# EAGLE schematic riser (EAGLE 7.7.0)

## Sheet 1 of 4: Host and PCIe Slot
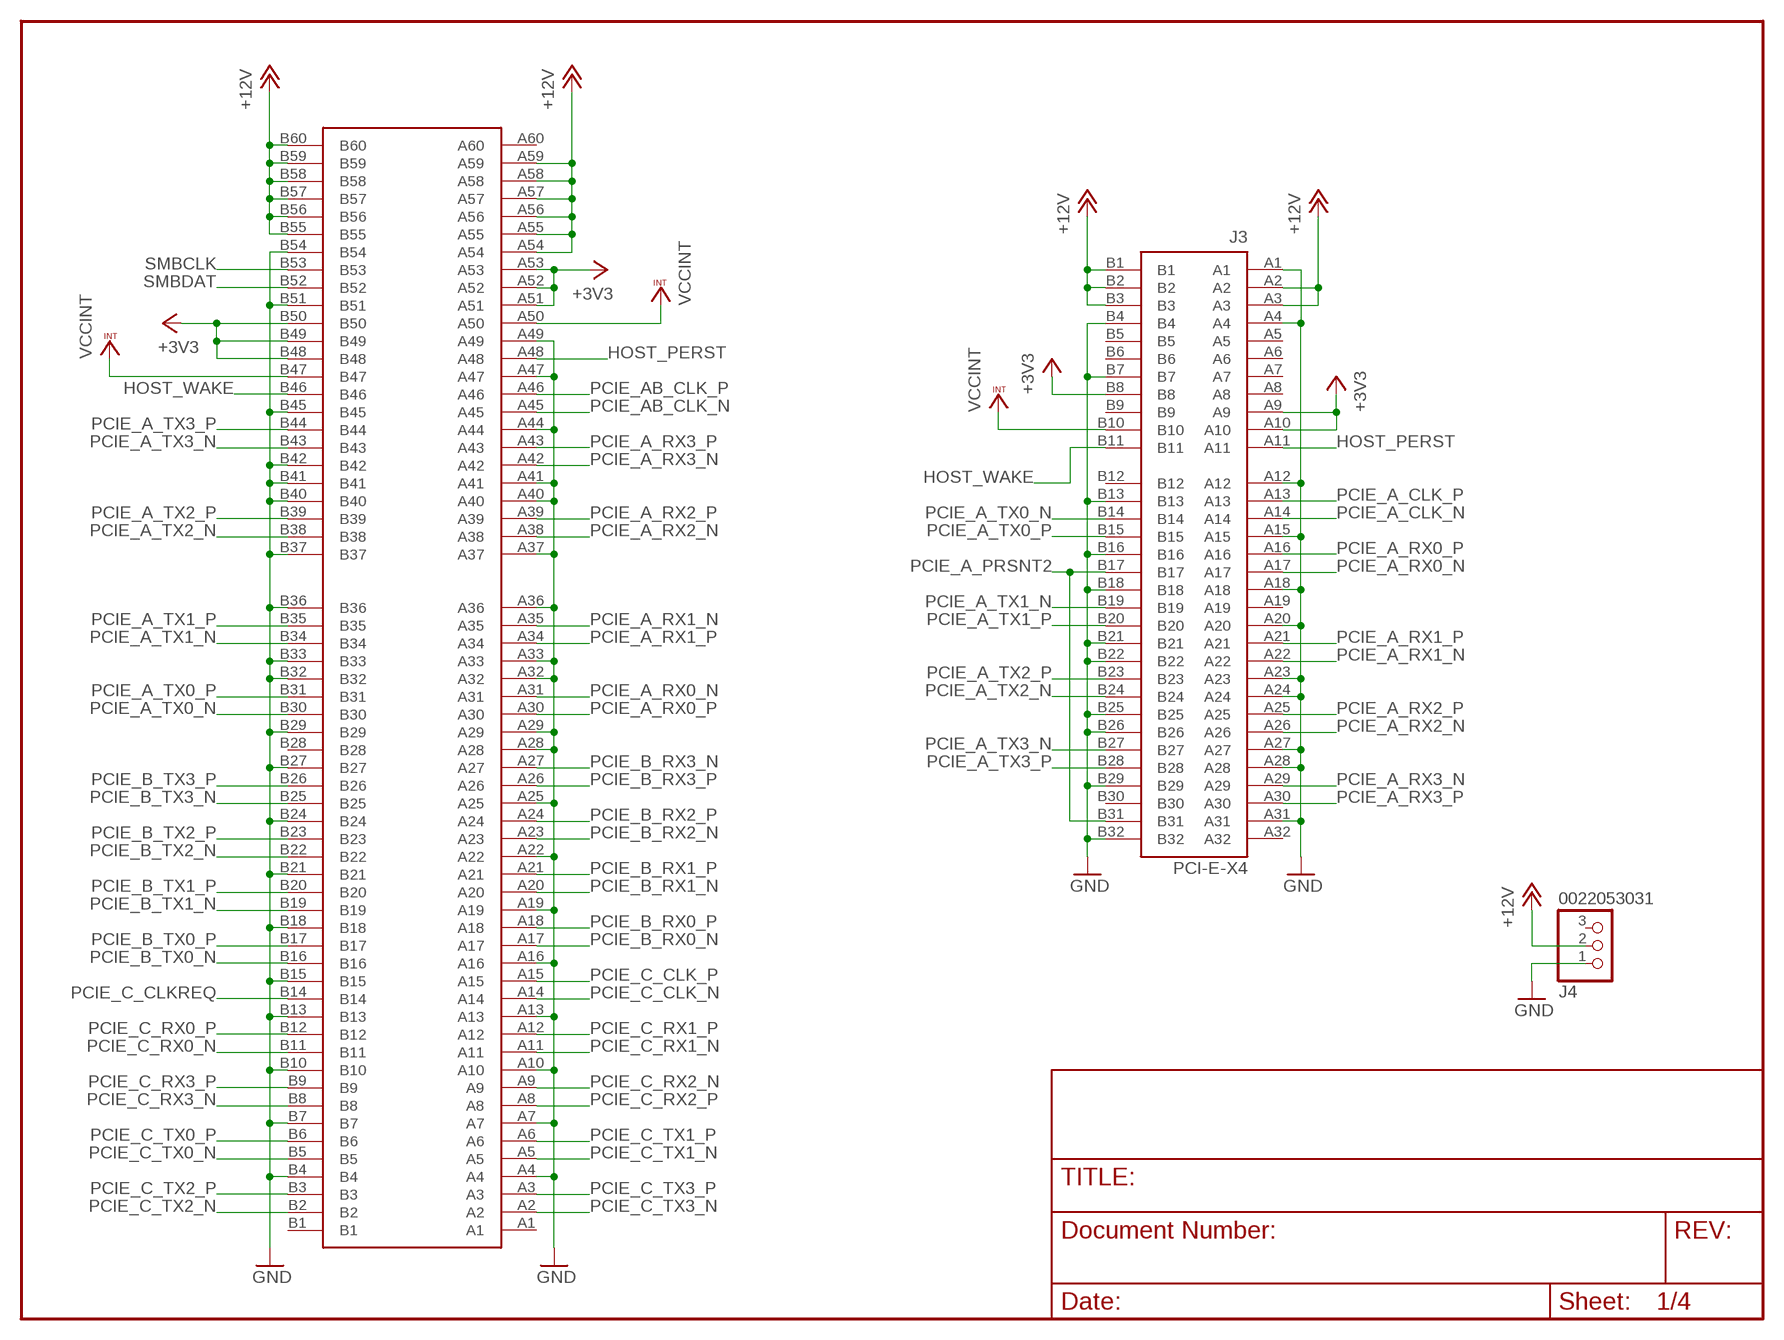
[diagram p0: schematic, sheet 1]

### Parts
J3  PCI-E-X4  [PCI-E-X4]
J4  0022053031  PINHD-1X3  [1X03]
JP1  ADDR0262  [ADDR0262-EDGE]

### Nets
+3V3: J3.A9 J3.A10 J3.B8 JP1.A51 JP1.A52 JP1.A53 JP1.B48 JP1.B49 JP1.B50 ; also sheet 3
+12V: J3.A2 J3.A3 J3.B1 J3.B2 J3.B3 J4.2 JP1.A54 JP1.A55 JP1.A56 JP1.A57 JP1.A58 JP1.A59 JP1.B55 JP1.B56 JP1.B57 JP1.B58 JP1.B59 JP1.B60 ; also sheet 3
GND: J3.A1 J3.A4 J3.A12 J3.A15 J3.A18 J3.A20 J3.A23 J3.A24 J3.A27 J3.A28 J3.A31 J3.B4 J3.B7 J3.B13 J3.B16 J3.B18 J3.B21 J3.B22 J3.B25 J3.B26 J3.B29 J3.B32 J4.1 JP1.A4 JP1.A7 JP1.A10 JP1.A13 JP1.A16 JP1.A19 JP1.A22 JP1.A25 JP1.A28 JP1.A29 JP1.A32 JP1.A33 JP1.A36 JP1.A37 JP1.A40 JP1.A41 JP1.A44 JP1.A47 JP1.A49 JP1.B4 JP1.B7 JP1.B10 JP1.B13 JP1.B15 JP1.B18 JP1.B21 JP1.B24 JP1.B27 JP1.B29 JP1.B32 JP1.B33 JP1.B36 JP1.B37 JP1.B40 JP1.B41 JP1.B42 JP1.B45 JP1.B51 JP1.B54 ; also sheet 2,3
HOST_PERST: J3.A11 JP1.A48 ; also sheet 3
HOST_WAKE: J3.B11 JP1.B46 ; also sheet 3
PCIE_A_CLK_N [pcie]: J3.A14 ; also sheet 3
PCIE_A_CLK_P [pcie]: J3.A13 ; also sheet 3
PCIE_A_PRSNT2: J3.B17 J3.B31 ; also sheet 3
PCIE_A_RX0_N [pcie]: J3.A17 JP1.A31
PCIE_A_RX0_P [pcie]: J3.A16 JP1.A30
PCIE_A_RX1_N [pcie]: J3.A22 JP1.A35
PCIE_A_RX1_P [pcie]: J3.A21 JP1.A34
PCIE_A_RX2_N [pcie]: J3.A26 JP1.A38
PCIE_A_RX2_P [pcie]: J3.A25 JP1.A39
PCIE_A_RX3_N [pcie]: J3.A29 JP1.A42
PCIE_A_RX3_P [pcie]: J3.A30 JP1.A43
PCIE_A_TX0_N [pcie]: J3.B14 JP1.B30
PCIE_A_TX0_P [pcie]: J3.B15 JP1.B31
PCIE_A_TX1_N [pcie]: J3.B19 JP1.B34
PCIE_A_TX1_P [pcie]: J3.B20 JP1.B35
PCIE_A_TX2_N [pcie]: J3.B24 JP1.B38
PCIE_A_TX2_P [pcie]: J3.B23 JP1.B39
PCIE_A_TX3_N [pcie]: J3.B27 JP1.B43
PCIE_A_TX3_P [pcie]: J3.B28 JP1.B44
PCIE_AB_CLK_N [pcie]: JP1.A45 ; also sheet 3
PCIE_AB_CLK_P [pcie]: JP1.A46 ; also sheet 3
PCIE_B_RX0_N [pcie]: JP1.A17 ; also sheet 2
PCIE_B_RX0_P [pcie]: JP1.A18 ; also sheet 2
PCIE_B_RX1_N [pcie]: JP1.A20 ; also sheet 2
PCIE_B_RX1_P [pcie]: JP1.A21 ; also sheet 2
PCIE_B_RX2_N [pcie]: JP1.A23 ; also sheet 2
PCIE_B_RX2_P [pcie]: JP1.A24 ; also sheet 2
PCIE_B_RX3_N [pcie]: JP1.A27 ; also sheet 2
PCIE_B_RX3_P [pcie]: JP1.A26 ; also sheet 2
PCIE_B_TX0_N [pcie]: JP1.B16 ; also sheet 2
PCIE_B_TX0_P [pcie]: JP1.B17 ; also sheet 2
PCIE_B_TX1_N [pcie]: JP1.B19 ; also sheet 2
PCIE_B_TX1_P [pcie]: JP1.B20 ; also sheet 2
PCIE_B_TX2_N [pcie]: JP1.B22 ; also sheet 2
PCIE_B_TX2_P [pcie]: JP1.B23 ; also sheet 2
PCIE_B_TX3_N [pcie]: JP1.B25 ; also sheet 2
PCIE_B_TX3_P [pcie]: JP1.B26 ; also sheet 2
PCIE_C_CLK_N [pcie]: JP1.A14 ; also sheet 2
PCIE_C_CLK_P [pcie]: JP1.A15 ; also sheet 2
PCIE_C_CLKREQ: JP1.B14 ; also sheet 2
PCIE_C_RX0_N [pcie]: JP1.B11 ; also sheet 2
PCIE_C_RX0_P [pcie]: JP1.B12 ; also sheet 2
PCIE_C_RX1_N [pcie]: JP1.A11 ; also sheet 2
PCIE_C_RX1_P [pcie]: JP1.A12 ; also sheet 2
PCIE_C_RX2_N [pcie]: JP1.A9 ; also sheet 2
PCIE_C_RX2_P [pcie]: JP1.A8 ; also sheet 2
PCIE_C_RX3_N [pcie]: JP1.B8 ; also sheet 2
PCIE_C_RX3_P [pcie]: JP1.B9 ; also sheet 2
PCIE_C_TX0_N [pcie]: JP1.B5 ; also sheet 2
PCIE_C_TX0_P [pcie]: JP1.B6 ; also sheet 2
PCIE_C_TX1_N [pcie]: JP1.A5 ; also sheet 2
PCIE_C_TX1_P [pcie]: JP1.A6 ; also sheet 2
PCIE_C_TX2_N [pcie]: JP1.B2 ; also sheet 2
PCIE_C_TX2_P [pcie]: JP1.B3 ; also sheet 2
PCIE_C_TX3_N [pcie]: JP1.A2 ; also sheet 2
PCIE_C_TX3_P [pcie]: JP1.A3 ; also sheet 2
SMBCLK: JP1.B53 ; also sheet 3
SMBDAT: JP1.B52 ; also sheet 3
VCCINT: J3.B10 JP1.A50 JP1.B47 ; also sheet 3
Unconnected: J3.A5 J3.A6 J3.A7 J3.A8 J3.A19 J3.A32 J3.B5 J3.B6 J3.B9 J3.B12 J3.B30 J4.3 JP1.A1 JP1.A60 JP1.B1 JP1.B28

## Sheet 2 of 4: M.2
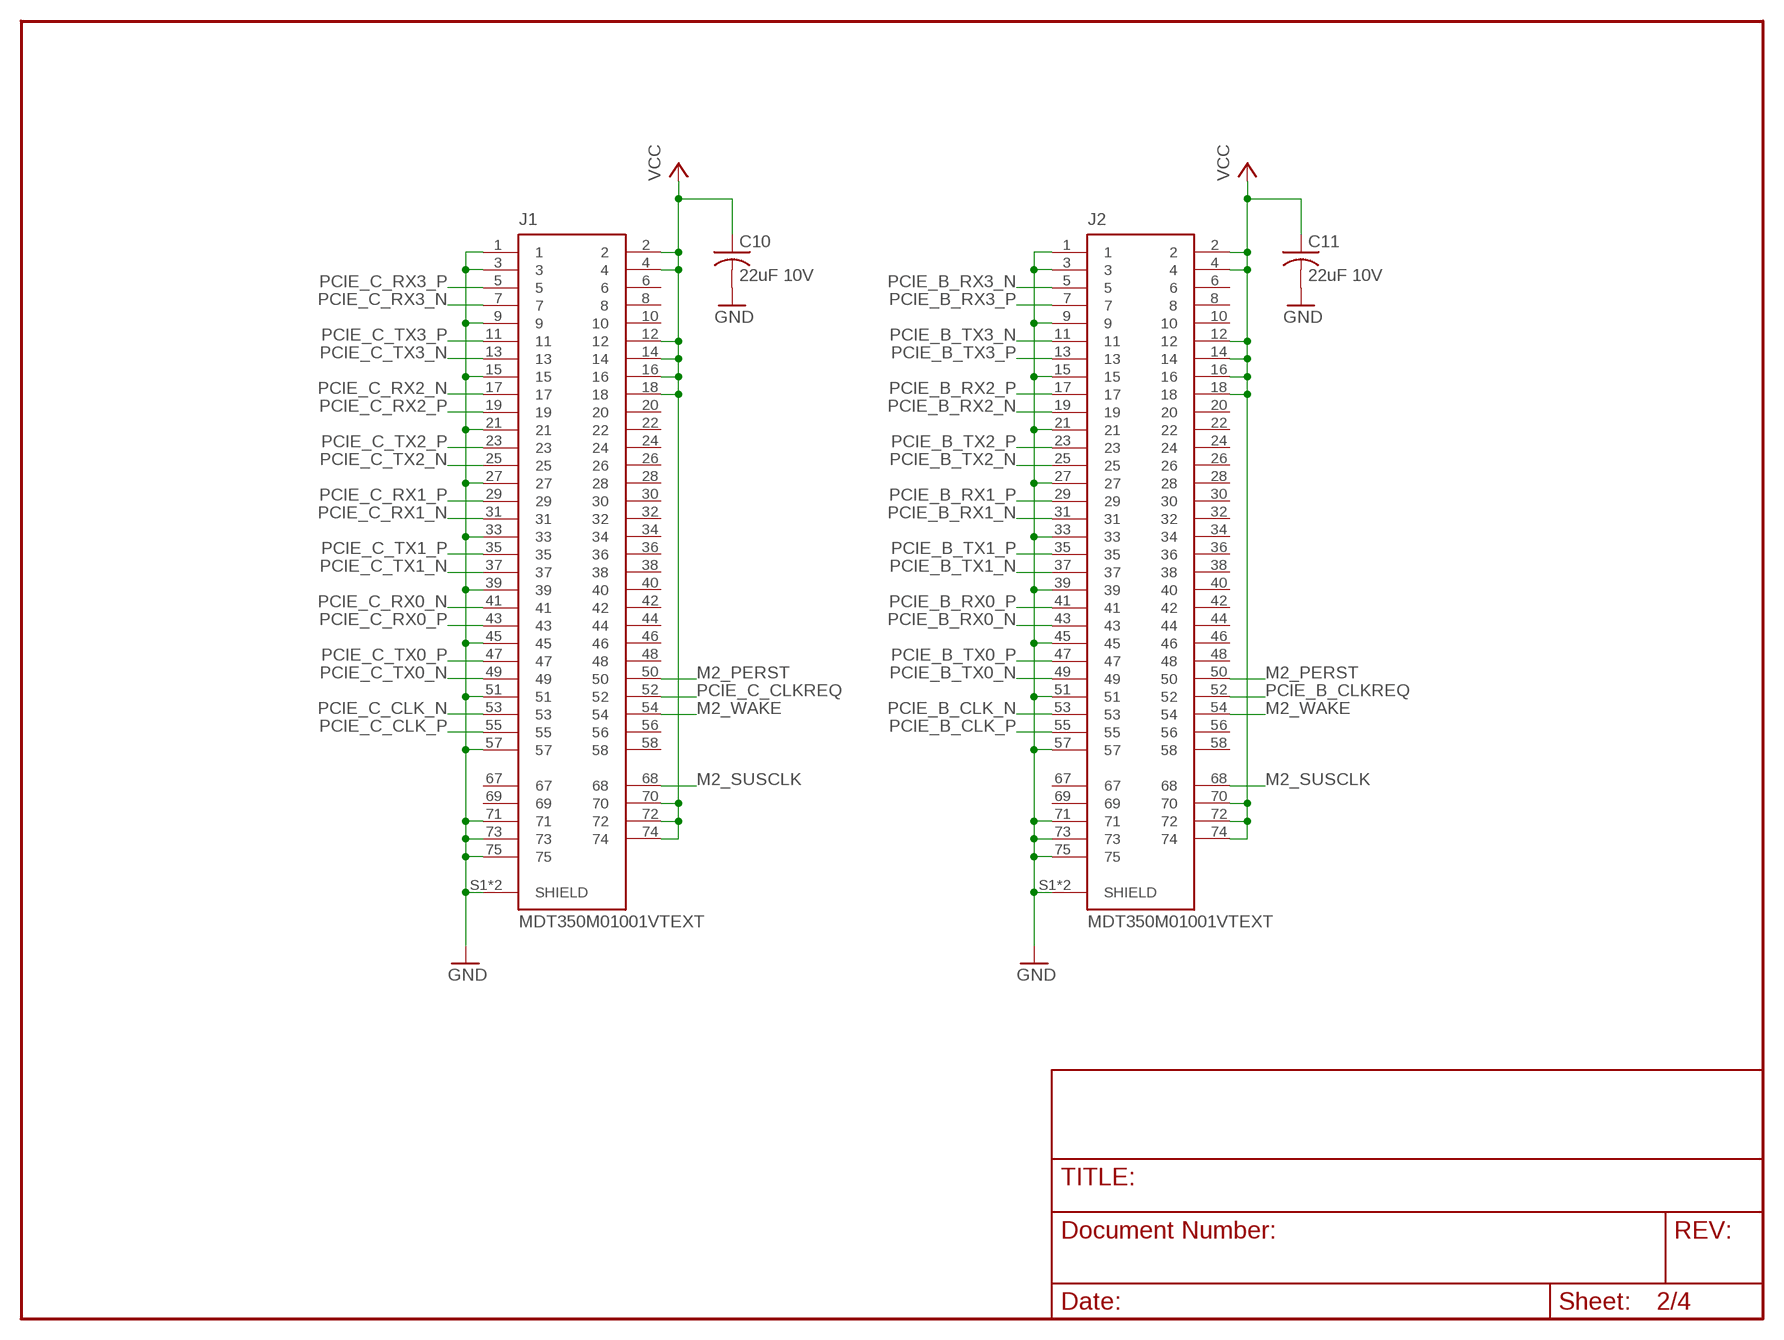
[diagram p1: schematic, sheet 2]

### Parts
C10  22uF 10V  C-USC0805  [C0805]
C11  22uF 10V  C-USC0805  [C0805]
J1  MDT350M01001VTEXT  [MDT350M01001VT_EXT]
J2  MDT350M01001VTEXT  [MDT350M01001VT_EXT]

### Nets
GND: C10.2 C11.2 J1.1 J1.3 J1.9 J1.15 J1.21 J1.27 J1.33 J1.39 J1.45 J1.51 J1.57 J1.71 J1.73 J1.75 J1.S1(SHIELD) J1.S2(SHIELD) J2.1 J2.3 J2.9 J2.15 J2.21 J2.27 J2.33 J2.39 J2.45 J2.51 J2.57 J2.71 J2.73 J2.75 J2.S1(SHIELD) J2.S2(SHIELD) ; also sheet 1,3
M2_PERST: J1.50 J2.50 ; also sheet 3
M2_SUSCLK: J1.68 J2.68 ; also sheet 3
M2_WAKE: J1.54 J2.54 ; also sheet 3
PCIE_B_CLK_N [pcie]: J2.53 ; also sheet 3
PCIE_B_CLK_P [pcie]: J2.55 ; also sheet 3
PCIE_B_CLKREQ: J2.52 ; also sheet 3
PCIE_B_RX0_N [pcie]: J2.43 ; also sheet 1
PCIE_B_RX0_P [pcie]: J2.41 ; also sheet 1
PCIE_B_RX1_N [pcie]: J2.31 ; also sheet 1
PCIE_B_RX1_P [pcie]: J2.29 ; also sheet 1
PCIE_B_RX2_N [pcie]: J2.19 ; also sheet 1
PCIE_B_RX2_P [pcie]: J2.17 ; also sheet 1
PCIE_B_RX3_N [pcie]: J2.5 ; also sheet 1
PCIE_B_RX3_P [pcie]: J2.7 ; also sheet 1
PCIE_B_TX0_N [pcie]: J2.49 ; also sheet 1
PCIE_B_TX0_P [pcie]: J2.47 ; also sheet 1
PCIE_B_TX1_N [pcie]: J2.37 ; also sheet 1
PCIE_B_TX1_P [pcie]: J2.35 ; also sheet 1
PCIE_B_TX2_N [pcie]: J2.25 ; also sheet 1
PCIE_B_TX2_P [pcie]: J2.23 ; also sheet 1
PCIE_B_TX3_N [pcie]: J2.11 ; also sheet 1
PCIE_B_TX3_P [pcie]: J2.13 ; also sheet 1
PCIE_C_CLK_N [pcie]: J1.53 ; also sheet 1
PCIE_C_CLK_P [pcie]: J1.55 ; also sheet 1
PCIE_C_CLKREQ: J1.52 ; also sheet 1
PCIE_C_RX0_N [pcie]: J1.41 ; also sheet 1
PCIE_C_RX0_P [pcie]: J1.43 ; also sheet 1
PCIE_C_RX1_N [pcie]: J1.31 ; also sheet 1
PCIE_C_RX1_P [pcie]: J1.29 ; also sheet 1
PCIE_C_RX2_N [pcie]: J1.17 ; also sheet 1
PCIE_C_RX2_P [pcie]: J1.19 ; also sheet 1
PCIE_C_RX3_N [pcie]: J1.7 ; also sheet 1
PCIE_C_RX3_P [pcie]: J1.5 ; also sheet 1
PCIE_C_TX0_N [pcie]: J1.49 ; also sheet 1
PCIE_C_TX0_P [pcie]: J1.47 ; also sheet 1
PCIE_C_TX1_N [pcie]: J1.37 ; also sheet 1
PCIE_C_TX1_P [pcie]: J1.35 ; also sheet 1
PCIE_C_TX2_N [pcie]: J1.25 ; also sheet 1
PCIE_C_TX2_P [pcie]: J1.23 ; also sheet 1
PCIE_C_TX3_N [pcie]: J1.13 ; also sheet 1
PCIE_C_TX3_P [pcie]: J1.11 ; also sheet 1
VCC: C10.1 C11.1 J1.2 J1.4 J1.12 J1.14 J1.16 J1.18 J1.70 J1.72 J1.74 J2.2 J2.4 J2.12 J2.14 J2.16 J2.18 J2.70 J2.72 J2.74 ; also sheet 3
Unconnected: J1.6 J1.8 J1.10 J1.20 J1.22 J1.24 J1.26 J1.28 J1.30 J1.32 J1.34 J1.36 J1.38 J1.40 J1.42 J1.44 J1.46 J1.48 J1.56 J1.58 J1.67 J1.69 J2.6 J2.8 J2.10 J2.20 J2.22 J2.24 J2.26 J2.28 J2.30 J2.32 J2.34 J2.36 J2.38 J2.40 J2.42 J2.44 J2.46 J2.48 J2.56 J2.58 J2.67 J2.69

## Sheet 3 of 4: Power and Control
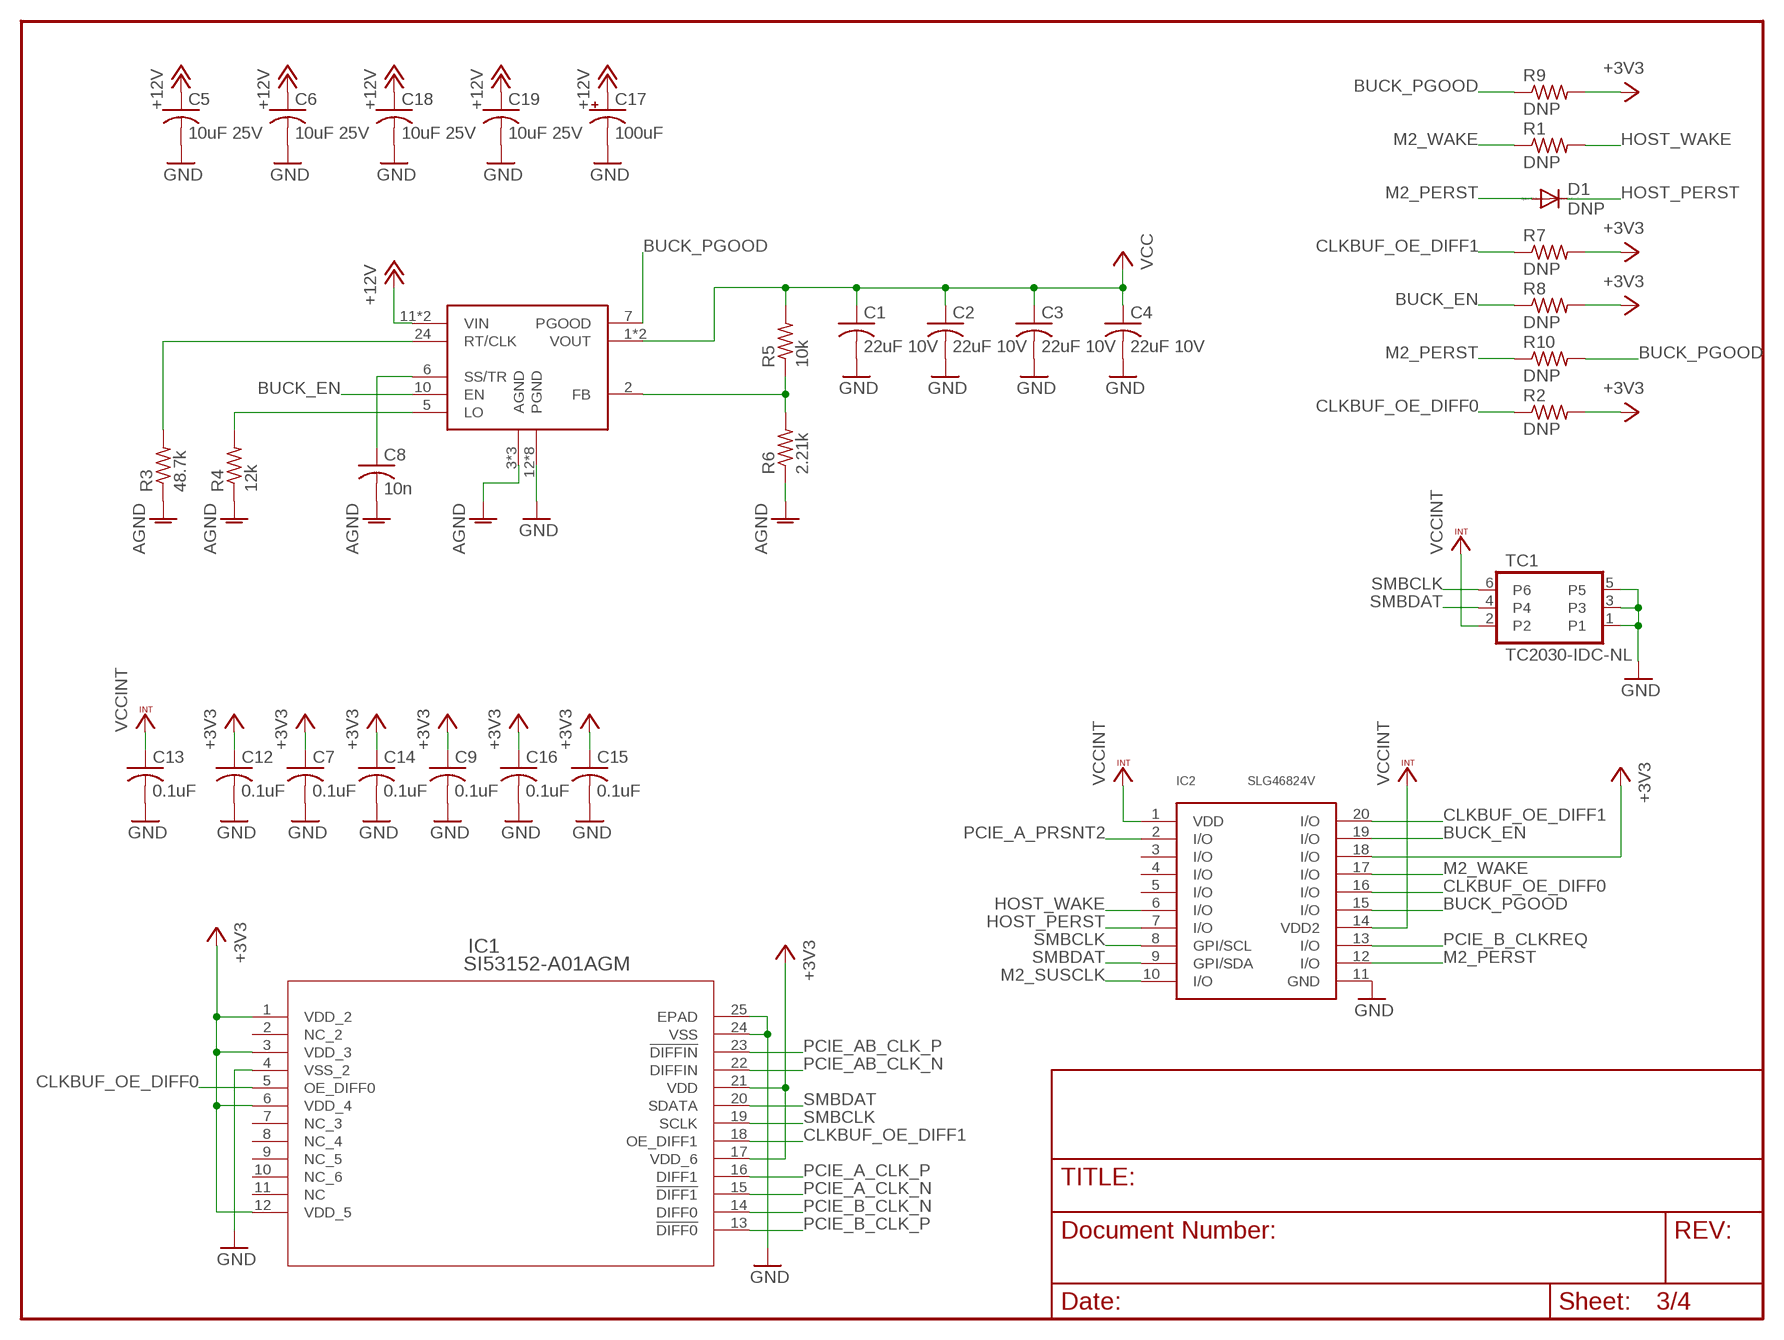
[diagram p2: schematic, sheet 3]

### Parts
C1  22uF 10V  C-USC0805  [C0805]
C2  22uF 10V  C-USC0805  [C0805]
C3  22uF 10V  C-USC0805  [C0805]
C4  22uF 10V  C-USC0805  [C0805]
C5  10uF 25V  C-USC1210  [C1210]
C6  10uF 25V  C-USC1210  [C1210]
C7  0.1uF  C-USC0402  [C0402]
C8  10n  C-USC0402  [C0402]
C9  0.1uF  C-USC0402  [C0402]
C12  0.1uF  C-USC0402  [C0402]
C13  0.1uF  C-USC0402  [C0402]
C14  0.1uF  C-USC0402  [C0402]
C15  0.1uF  C-USC0402  [C0402]
C16  0.1uF  C-USC0402  [C0402]
C17  100uF  CPOL-USE2.5-7  [E2,5-7]
C18  10uF 25V  C-USC0805  [C0805]
C19  10uF 25V  C-USC0805  [C0805]
D1  DNP  DIODE-SOD323-R  [SOD323-R]
IC1  SI53152-A01AGM  [QFN24_4X4_SIL]
IC2  SLG46824V  [STQFN-20L-2.0X2.2-#4]
R1  DNP  R-US_R0402  [R0402]
R2  DNP  R-US_R0402  [R0402]
R3  48.7k  R-US_R0402  [R0402]
R4  12k  R-US_R0402  [R0402]
R5  10k  R-US_R0402  [R0402]
R6  2.21k  R-US_R0402  [R0402]
R7  DNP  R-US_R0402  [R0402]
R8  DNP  R-US_R0402  [R0402]
R9  DNP  R-US_R0402  [R0402]
R10  DNP  R-US_R0402  [R0402]
TC1  TC2030-IDC-NL  [TC2030-IDC-NL]
U1  PMU8000  [PMU8000]

### Nets
+3V3: C7.1 C9.1 C12.1 C14.1 C15.1 C16.1 IC1.1(VDD_2) IC1.3(VDD_3) IC1.6(VDD_4) IC1.12(VDD_5) IC1.17(VDD_6) IC1.21(VDD) IC2.18(I/O) R2.2 R7.2 R8.2 R9.2 ; also sheet 1
+12V: C5.1 C6.1 C17.+ C18.1 C19.1 U1.11(VIN) U1.22(VIN) ; also sheet 1
AGND: C8.2 R3.1 R4.1 R6.1 U1.3(AGND) U1.9(AGND) U1.23(AGND)
BUCK_EN: IC2.19(I/O) R8.1 U1.10(EN)
BUCK_PGOOD: IC2.15(I/O) R9.1 R10.2 U1.7(PGOOD)
CLKBUF_OE_DIFF0: IC1.5(OE_DIFF0) IC2.16(I/O) R2.1
CLKBUF_OE_DIFF1: IC1.18(OE_DIFF1) IC2.20(I/O) R7.1
FB: R5.1 R6.2 U1.2(FB)
GND: C1.2 C2.2 C3.2 C4.2 C5.2 C6.2 C7.2 C9.2 C12.2 C13.2 C14.2 C15.2 C16.2 C17.- C18.2 C19.2 IC1.4(VSS_2) IC1.24(VSS) IC1.25(EPAD) IC2.11(GND) TC1.1 TC1.3 TC1.5 U1.12(PGND) U1.13(PGND) U1.14(PGND) U1.15(PGND) U1.18(PGND) U1.19(PGND) U1.20(PGND) U1.21(PGND) ; also sheet 1,2
HOST_PERST: D1.C IC2.7(I/O) ; also sheet 1
HOST_WAKE: IC2.6(I/O) R1.2 ; also sheet 1
M2_PERST: D1.A IC2.12(I/O) R10.1 ; also sheet 2
M2_SUSCLK: IC2.10(I/O) ; also sheet 2
M2_WAKE: IC2.17(I/O) R1.1 ; also sheet 2
PCIE_A_CLK_N [pcie]: IC1.15(!DIFF1) ; also sheet 1
PCIE_A_CLK_P [pcie]: IC1.16(DIFF1) ; also sheet 1
PCIE_A_PRSNT2: IC2.2(I/O) ; also sheet 1
PCIE_AB_CLK_N [pcie]: IC1.22(DIFFIN) ; also sheet 1
PCIE_AB_CLK_P [pcie]: IC1.23(!DIFFIN) ; also sheet 1
PCIE_B_CLK_N [pcie]: IC1.14(DIFF0) ; also sheet 2
PCIE_B_CLK_P [pcie]: IC1.13(!DIFF0) ; also sheet 2
PCIE_B_CLKREQ: IC2.13(I/O) ; also sheet 2
SMBCLK: IC1.19(SCLK) IC2.8(GPI/SCL) TC1.6 ; also sheet 1
SMBDAT: IC1.20(SDATA) IC2.9(GPI/SDA) TC1.4 ; also sheet 1
VCC: C1.1 C2.1 C3.1 C4.1 R5.2 U1.1(VOUT) U1.8(VOUT) ; also sheet 2
VCCINT: C13.1 IC2.1(VDD) IC2.14(VDD2) TC1.2 ; also sheet 1
VREG_CSS: C8.1 U1.6(SS/TR)
VREG_LO: R4.2 U1.5(LO)
VREG_RT: R3.2 U1.24(RT/CLK)
Unconnected: IC1.2(NC_2) IC1.7(NC_3) IC1.8(NC_4) IC1.9(NC_5) IC1.10(NC_6) IC1.11(NC) IC2.3(I/O) IC2.4(I/O) IC2.5(I/O)

## Sheet 4 of 4: Block Diagram
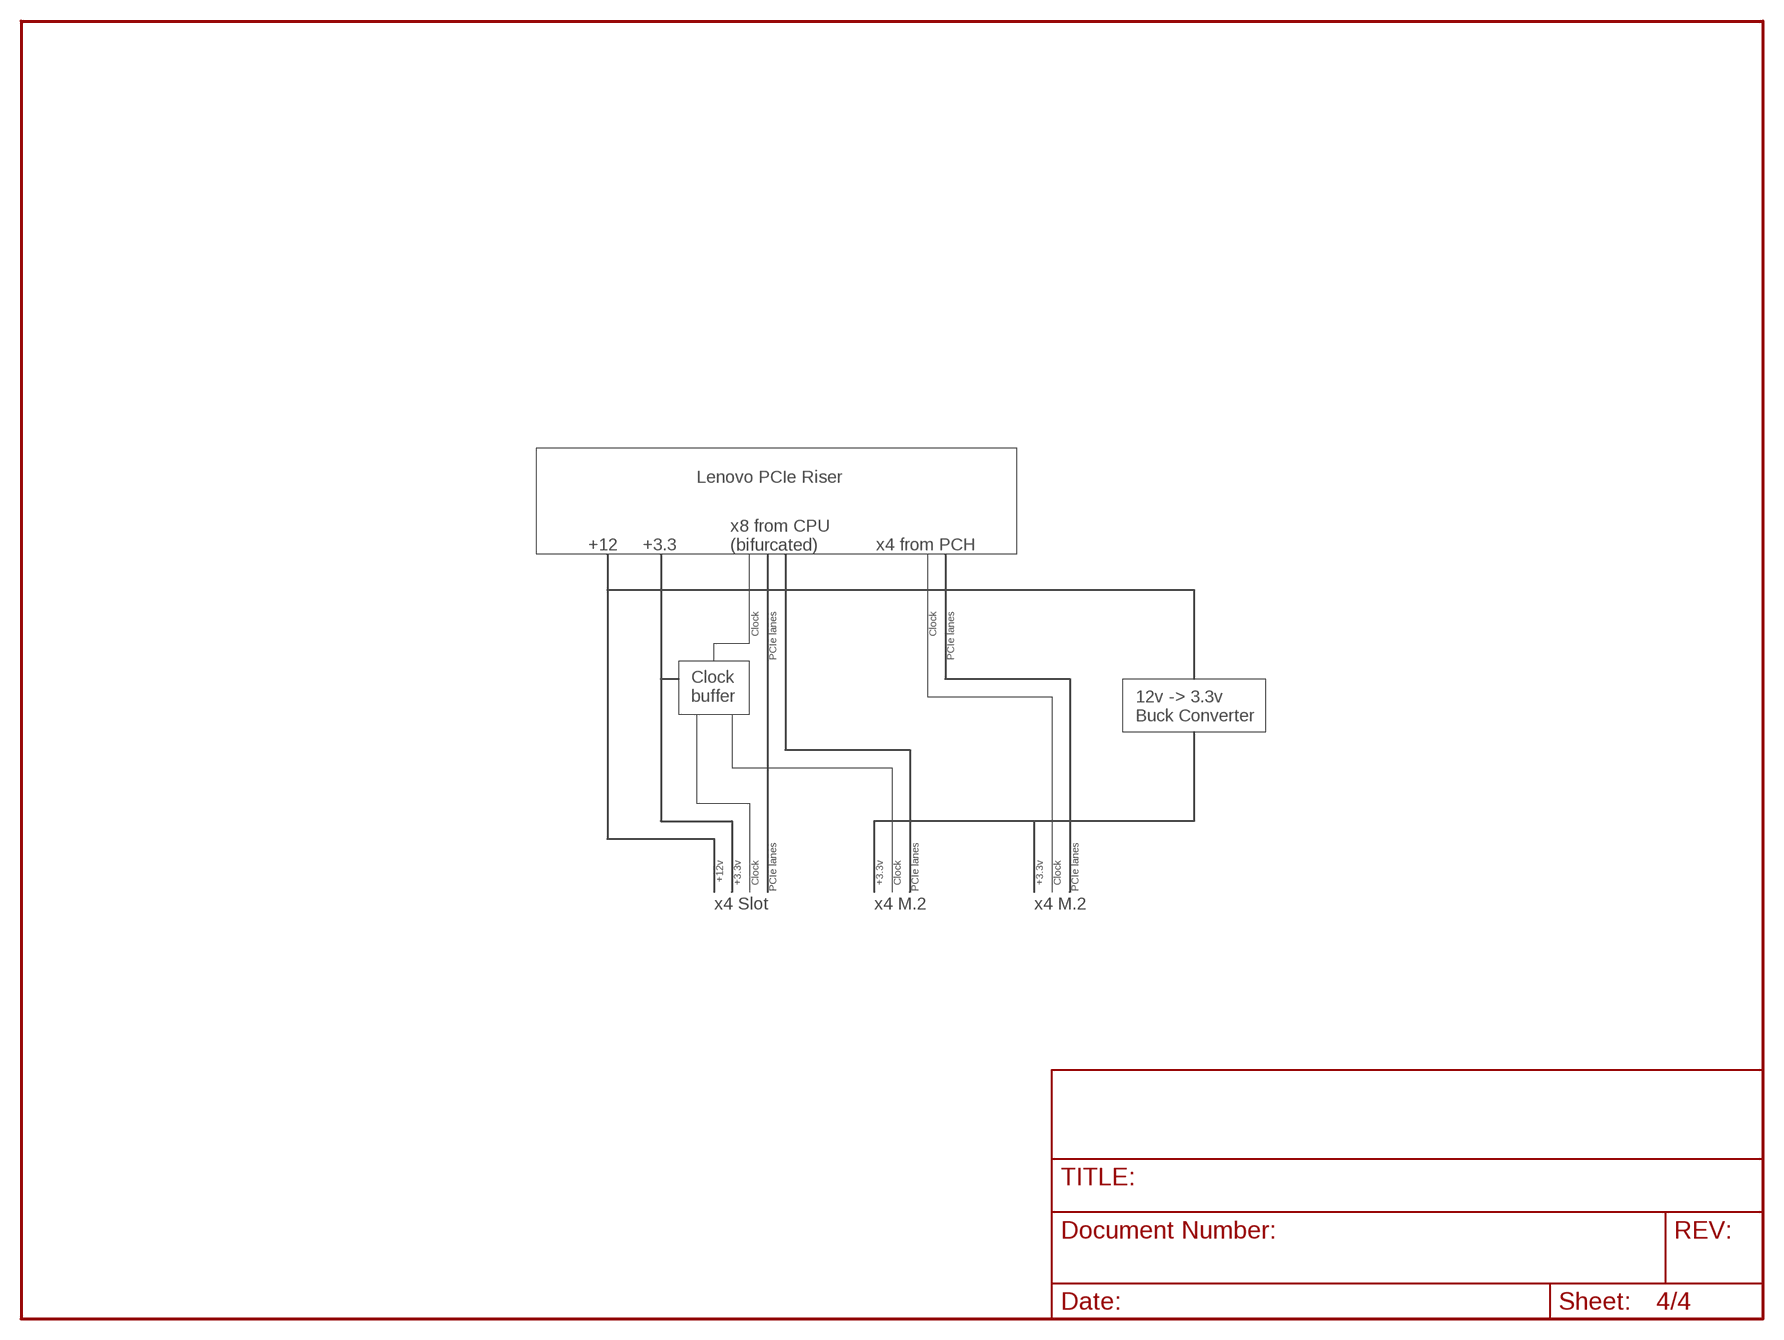
[diagram p3: schematic, sheet 4]

### Notes on the sheet
- Lenovo PCIe Riser
- +12     +3.3
- x8 from CPU
  (bifurcated)
- x4 from PCH
- Clock | PCIe lanes | Clock | PCIe lanes
- Clock
  buffer
- 12v -> 3.3v
  Buck Converter
- PCIe lanes | PCIe lanes | PCIe lanes
- +12v | +3.3v | Clock | +3.3v | Clock | +3.3v | Clock
- x4 Slot | x4 M.2 | x4 M.2

## Library data of the parts
C1-C6 C10 C11 C18 C19 = resistor:C-US: CAPACITOR, American symbol
C7-C9 C12-C16 = rcl:C-US: CAPACITOR, American symbol
C17 = rcl:CPOL-US: POLARIZED CAPACITOR, American symbol
D1 = diode:DIODE-: DIODE
IC1 = lenovo:SI53152-A01AGM; COPYRIGHT: Copyright (C) 2024 Ultra Librarian. All rights reserved.; MANUFACTURER_PART_NUMBER: SI53152-A01AGM; MFR_NAME: Silicon Labs
IC2 = GPAK:SLG46824V
J1 J2 = MDT350M01001VT:MDT350M01001VT: 67 Position Female Connector M.2 (NGFF) Mini Card Gold 0.020" (0.50mm) Black Check availability <https://pricing.snapeda.com/parts/MDT350M01001VT/AMPHENOL%20ICC%20/%20FCI/view-part?ref=eda>
J3 = lenovo:PCI-E-X4
J4 = pinhead:PINHD-1X3: PIN HEADER
JP1 = lenovo:ADDR0262
R1-R10 = rcl:R-US_: RESISTOR, American symbol
TC1 = tc-j4cbo:TC2030-IDC: Tag-Connect In Circuit Programming & Debug Cable 6 Pin http://www.tag-connect.com
U1 = lenovo:PMU8000

## Net classes
1 pcie: width 0.158 mm, clearance 0.102 mm